# Altium schematic sheet MB1296-Top.SchDoc: Top
size A4; Date: 18-AUG-2016; Organization: STMicroelectronics; Address1: Microcontrollers Division; Address2: 190, avenue Célestin COQ; Address3: 13106 ROUSSET Cedex; Address4: FRANCE; DocumentNumber: MB1296; Revision: C-01; SheetNumber: 1; SheetTotal: 6; Project: STM32 LoRa Discovery
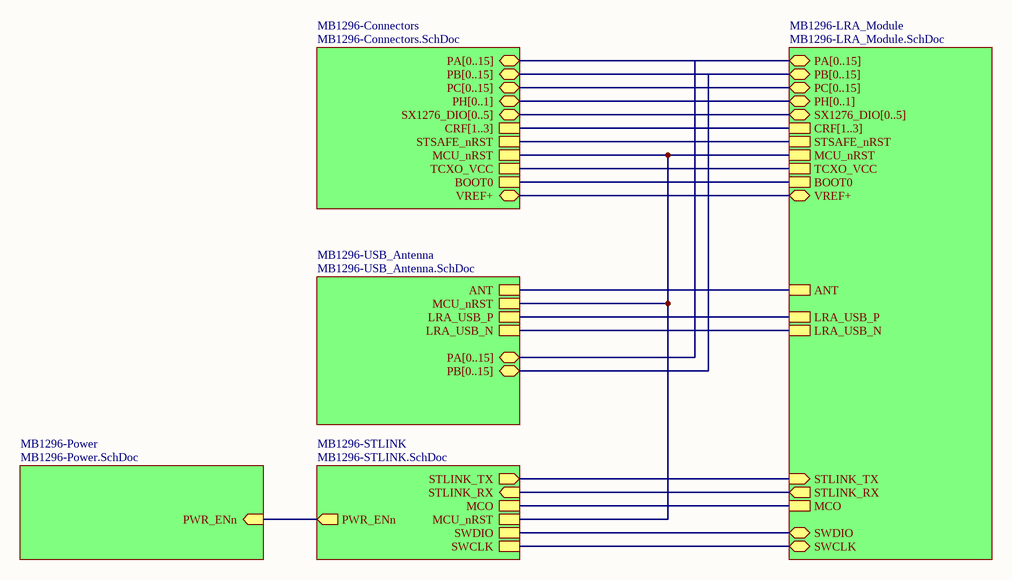
[diagram p0: MB1296-Top.SchDoc]

## Sub-sheets
MB1296-Connectors = MB1296-Connectors.SchDoc: PA[0..15] (bidir), PB[0..15] (bidir), PC[0..15] (bidir), MCU_nRST, BOOT0, SX1276_DIO[0..5] (bidir), CRF[1..3], TCXO_VCC, PH[0..1] (bidir), STSAFE_nRST, VREF+
MB1296-LRA_Module = MB1296-LRA_Module.SchDoc: LRA_USB_P, LRA_USB_N, STLINK_TX (in), STLINK_RX (out), ANT, STSAFE_nRST, MCU_nRST, TCXO_VCC, MCO, PA[0..15] (bidir), PB[0..15] (bidir), PC[0..15] (bidir), SX1276_DIO[0..5] (bidir), CRF[1..3], BOOT0, PH[0..1] (bidir), SWDIO, SWCLK, VREF+
MB1296-Power = MB1296-Power.SchDoc: PWR_ENn (in)
MB1296-STLINK = MB1296-STLINK.SchDoc: SWCLK, SWDIO, MCO, MCU_nRST, STLINK_RX (in), STLINK_TX (out), PWR_ENn (out)
MB1296-USB_Antenna = MB1296-USB_Antenna.SchDoc: LRA_USB_N, LRA_USB_P, MCU_nRST, ANT, PA[0..15] (bidir), PB[0..15] (bidir)

## Nets
(unnamed): sheet MB1296-Connectors/MCU_nRST, sheet MB1296-USB_Antenna/MCU_nRST, sheet MB1296-STLINK/MCU_nRST, sheet MB1296-LRA_Module/MCU_nRST
(unnamed): sheet MB1296-Connectors/BOOT0, sheet MB1296-LRA_Module/BOOT0
(unnamed): sheet MB1296-Connectors/TCXO_VCC, sheet MB1296-LRA_Module/TCXO_VCC
(unnamed): sheet MB1296-Connectors/STSAFE_nRST, sheet MB1296-LRA_Module/STSAFE_nRST
(unnamed): sheet MB1296-Connectors/VREF+, sheet MB1296-LRA_Module/VREF+
(unnamed): sheet MB1296-USB_Antenna/LRA_USB_N, sheet MB1296-LRA_Module/LRA_USB_N
(unnamed): sheet MB1296-USB_Antenna/LRA_USB_P, sheet MB1296-LRA_Module/LRA_USB_P
(unnamed): sheet MB1296-USB_Antenna/ANT, sheet MB1296-LRA_Module/ANT
(unnamed): sheet MB1296-STLINK/SWCLK, sheet MB1296-LRA_Module/SWCLK
(unnamed): sheet MB1296-STLINK/SWDIO, sheet MB1296-LRA_Module/SWDIO
(unnamed): sheet MB1296-STLINK/MCO, sheet MB1296-LRA_Module/MCO
(unnamed): sheet MB1296-STLINK/STLINK_RX, sheet MB1296-LRA_Module/STLINK_RX
(unnamed): sheet MB1296-STLINK/STLINK_TX, sheet MB1296-LRA_Module/STLINK_TX
(unnamed): sheet MB1296-STLINK/PWR_ENn, sheet MB1296-Power/PWR_ENn

## Buses and harness runs
bus sheet MB1296-Connectors/CRF[1..3] = sheet MB1296-LRA_Module/CRF[1..3]
bus sheet MB1296-Connectors/PA[0..15] = sheet MB1296-LRA_Module/PA[0..15] = sheet MB1296-USB_Antenna/PA[0..15]
bus sheet MB1296-Connectors/PB[0..15] = sheet MB1296-LRA_Module/PB[0..15] = sheet MB1296-USB_Antenna/PB[0..15]
bus sheet MB1296-Connectors/PC[0..15] = sheet MB1296-LRA_Module/PC[0..15]
bus sheet MB1296-Connectors/PH[0..1] = sheet MB1296-LRA_Module/PH[0..1]
bus sheet MB1296-Connectors/SX1276_DIO[0..5] = sheet MB1296-LRA_Module/SX1276_DIO[0..5]

## Notes on the sheet
- Title:
- Project:
- Size:
- Date:
- A4
- Reference:
- Sheet:
- Revision:
- of